# EAGLE design board (EAGLE 7.7.0)
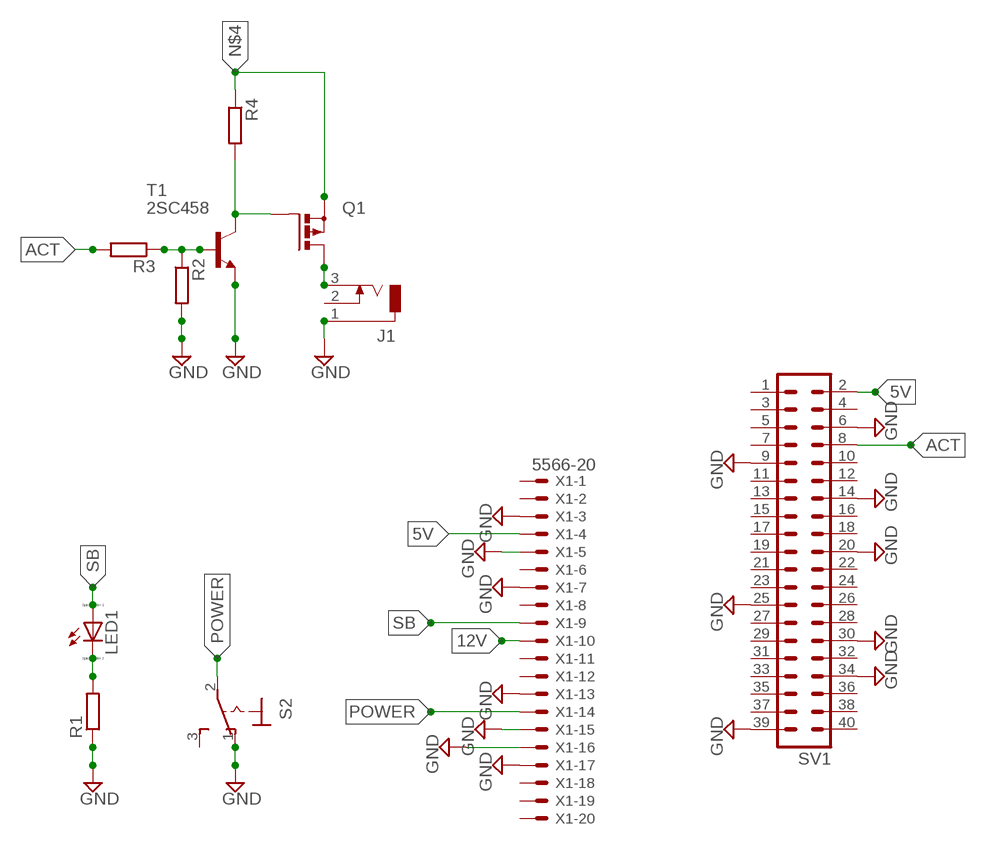
[diagram p0: schematic, sheet 1]

## Parts
J1  DCJ0303  [DCJ0303]
LED1  LED_ELD260  [LED_LD260]
Q1  PMOSFET_PTO220BV  [TO220BV]
R1  R-EU_0309/10  [0309/10]
R2  R-EU_0309/10  [0309/10]
R3  R-EU_0309/10  [0309/10]
R4  R-EU_0309/10  [0309/10]
S2  320-916  [320-916]
SV1  MA20-2  [MA20-2]
T1  2SC458  [TO92-ECB]
X1  5566-20  [5566-20]

## Nets
5V: SV1.2 X1.4
12V: X1.10
ACT: R3.2 SV1.8
GND: J1.1 R1.1 R2.2 S2.1(O) SV1.6 SV1.9 SV1.14 SV1.20 SV1.25 SV1.30 SV1.34 SV1.39 T1.E X1.3 X1.5 X1.7 X1.13 X1.15 X1.16 X1.17
N$1: LED1.K(C) R1.2
N$2: R2.1 R3.1 T1.B
N$3: Q1.G R4.2 T1.C
N$4: Q1.S R4.1
N$5: J1.3 Q1.D
POWER: S2.2(P) X1.14
SB: LED1.A X1.9
Unconnected: J1.2 S2.3(S) SV1.1 SV1.3 SV1.4 SV1.5 SV1.7 SV1.10 SV1.11 SV1.12 SV1.13 SV1.15 SV1.16 SV1.17 SV1.18 SV1.19 SV1.21 SV1.22 SV1.23 SV1.24 SV1.26 SV1.27 SV1.28 SV1.29 SV1.31 SV1.32 SV1.33 SV1.35 SV1.36 SV1.37 SV1.38 SV1.40 X1.1 X1.2 X1.6 X1.8 X1.11 X1.12 X1.18 X1.19 X1.20

## Library data of the parts
J1 = con-jack:DCJ0303: DC POWER JACK Source: DCJ0303.pdf; OC_FARNELL: unknown; OC_NEWARK: unknown
LED1 = eagle-ltspice:LED_E: LED Source: http://www.osram.convergy.de Source: www.luxeon.com Source: www.kingbright.com; SPICEMODEL: NONE; SPICEPREFIX: D; SPICETYPE: diode
Q1 = transistor-power:PMOSFET_P: Power MOSFET P-Channel
R1-R4 = resistor:R-EU_: RESISTOR, European symbol
S2 = switch:320-916: TOGGLE SWITCH distributor RS Components
SV1 = con-lstb:MA20-2: PIN HEADER; OC_FARNELL: unknown; OC_NEWARK: unknown
T1 = transistor:2SC458: NPN Silicon Epitaxial Planar Transistor Source: SEMTECH ELECTRONICS LTD. ... 2SC458 1.pdf
X1 = con-molex:5566-20: Mini FIT connector 20 pol ATX PC-Motherboard Power connector Source: http://www.molex.com; OC_FARNELL: unknown; OC_NEWARK: unknown

## Board
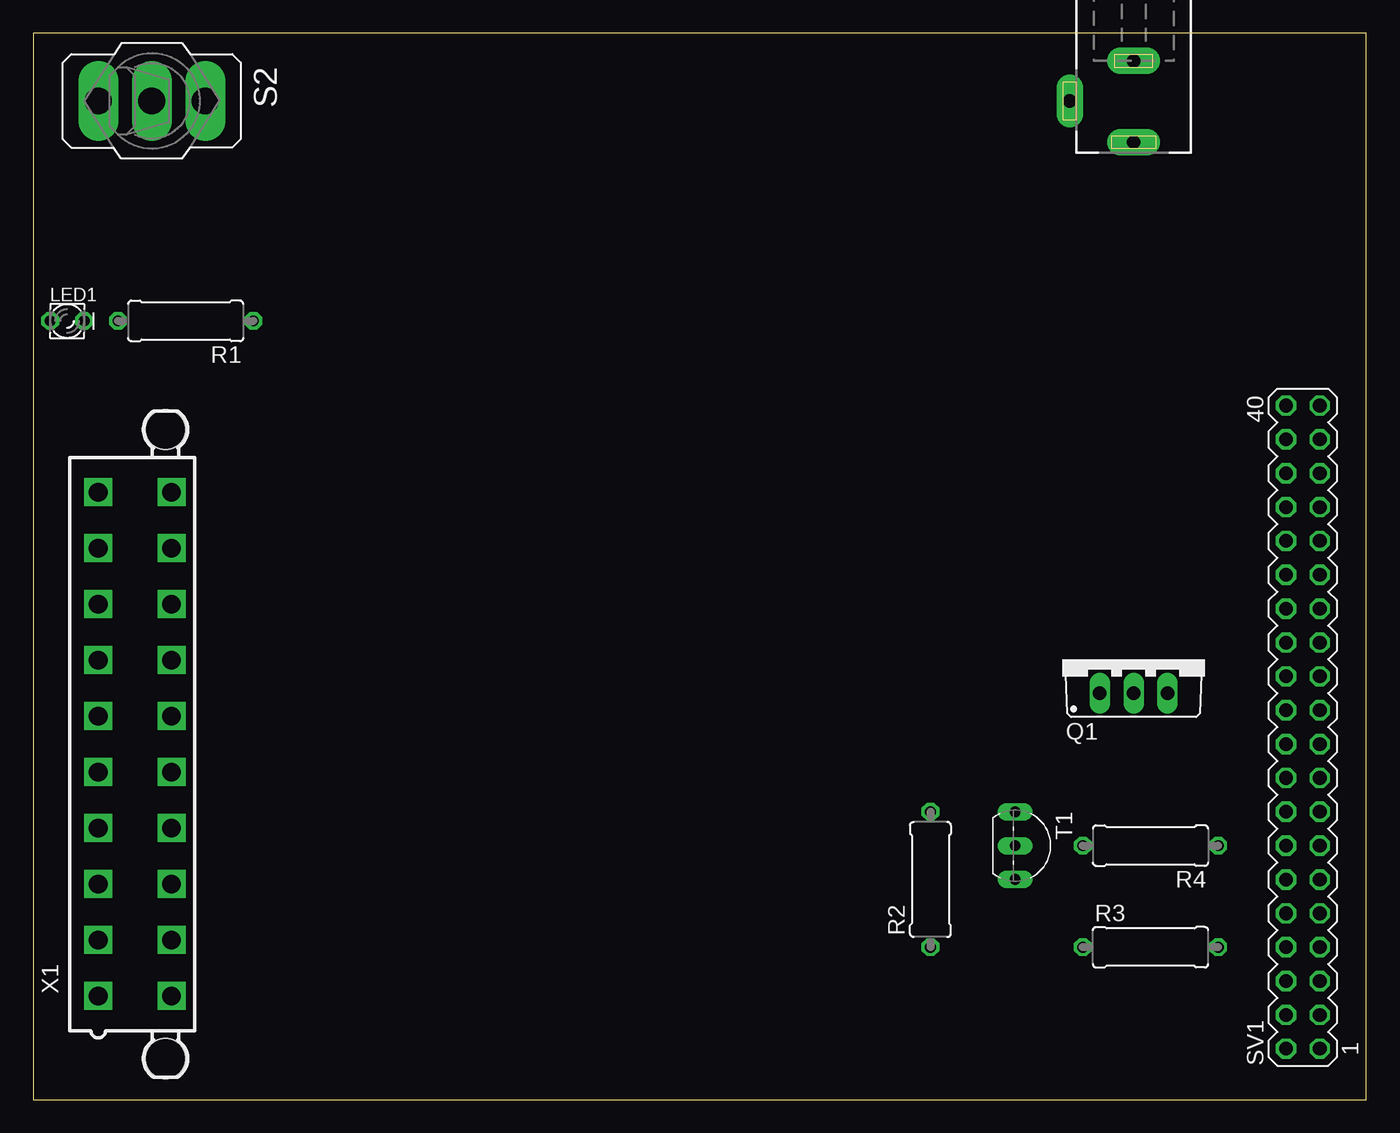
[diagram p1: board, top side]
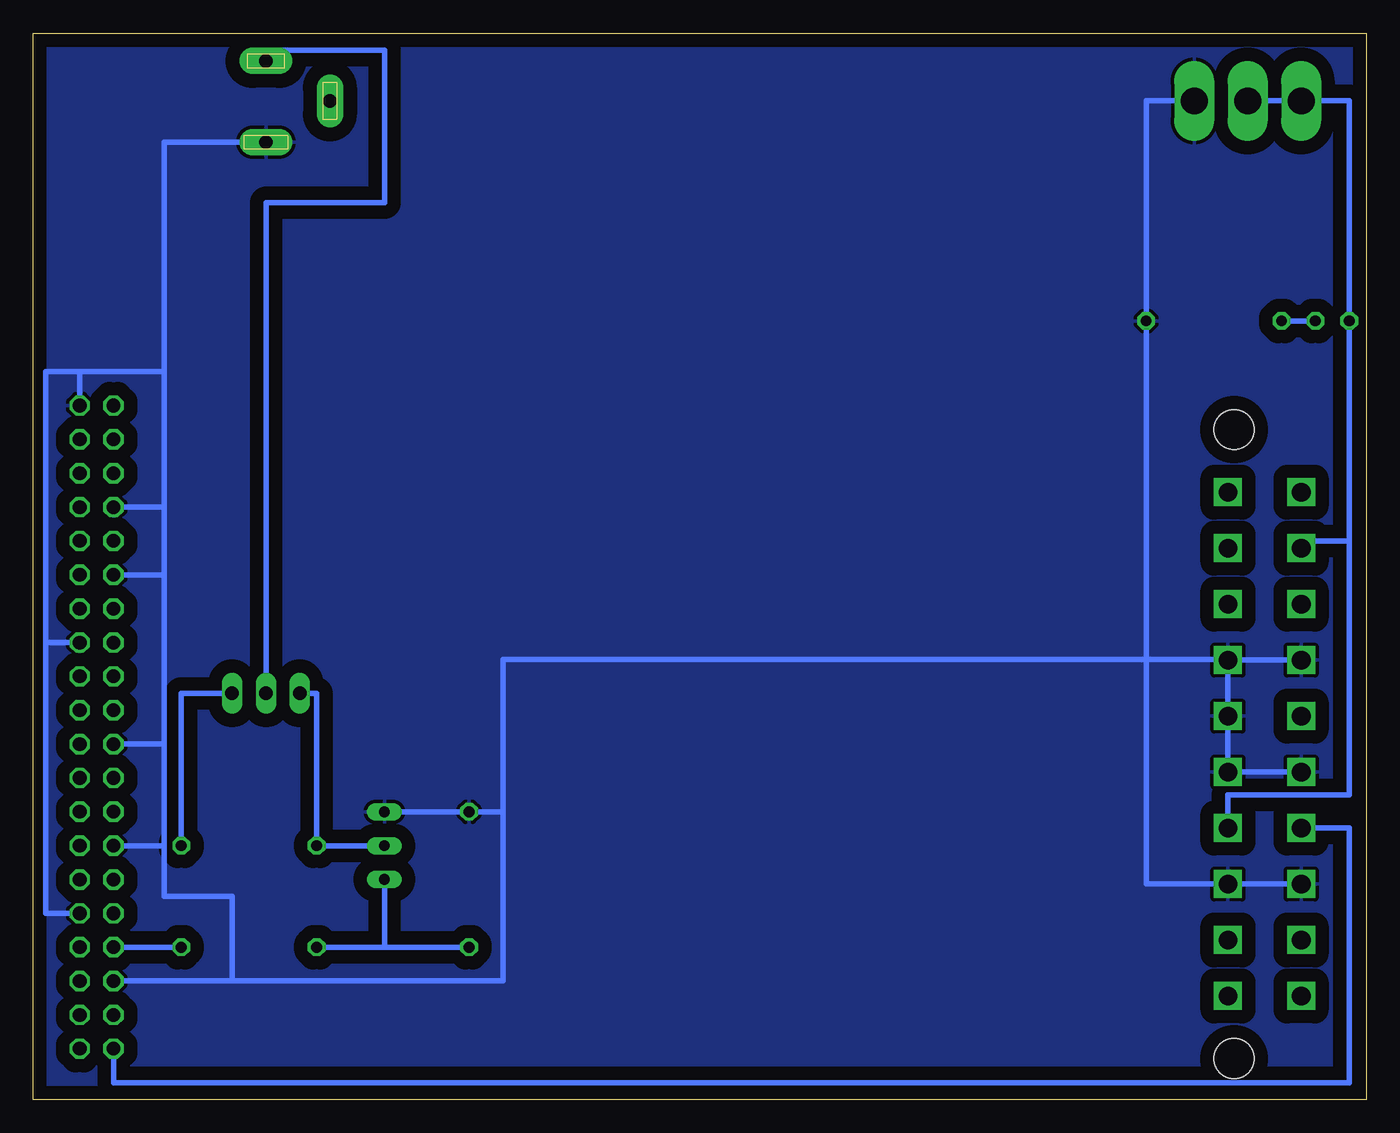
[diagram p2: board, bottom side, seen from below]

Size 100 x 80 mm. Coordinates in mm from the lower left corner, seen from the top.
Outline: 0,0 100,0 100,80 0,80 0,0
Copper layers (1*16): Top 0.035mm / dielectric 1.5mm / Bottom 0.035mm
Design rules "default": minimum track width 10mil, minimum drill 24mil, track to track 8mil, track to pad 8mil, pad to pad 8mil, via to via 8mil, smd to smd 8mil, copper to edge 40mil, drill to drill 8mil, minimum pad ring 10mil, minimum via ring 8mil, stop-mask expansion 4mil, vias tented up to drill 0mil, thermal gap 10mil

### Footprints (pad centres in the part's own frame; a part is rotated, then mirrored left to right if it is on the bottom)
DCJ0303 = drill 1 pad 2 long: 1 0,3.1; 2 4.8,0; 3 0,-3
LED_LD260 = drill 0.813 octagon: A -1.27,0; K 1.27,0
TO220BV = drill 1.016 long: D 0,-2.54; G -2.54,-2.54; S 2.54,-2.54
0309/10 = drill 0.813 octagon: 1 -5.08,0; 2 5.08,0
320-916 = drill 2.007 long: 1 0,4.013; 2 0,0; 3 0,-4.013
MA20-2 = drill 1.016 octagon: 1 -24.13,-1.27; 2 -24.13,1.27; 3 -21.59,-1.27; 4 -21.59,1.27; 5 -19.05,-1.27; 6 -19.05,1.27; 7 -16.51,-1.27; 8 -16.51,1.27; 9 -13.97,-1.27; 10 -13.97,1.27; 11 -11.43,-1.27; 12 -11.43,1.27; 13 -8.89,-1.27; 14 -8.89,1.27; 15 -6.35,-1.27; 16 -6.35,1.27; 17 -3.81,-1.27; 18 -3.81,1.27; 19 -1.27,-1.27; 20 -1.27,1.27; 21 1.27,-1.27; 22 1.27,1.27; 23 3.81,-1.27; 24 3.81,1.27; 25 6.35,-1.27; 26 6.35,1.27; 27 8.89,-1.27; 28 8.89,1.27; 29 11.43,-1.27; 30 11.43,1.27; 31 13.97,-1.27; 32 13.97,1.27; 33 16.51,-1.27; 34 16.51,1.27; 35 19.05,-1.27; 36 19.05,1.27; 37 21.59,-1.27; 38 21.59,1.27; 39 24.13,-1.27; 40 24.13,1.27
TO92-ECB = drill 0.813 long: B 2.54,0; C 0,0; E -2.54,0
5566-20 = drill 1.4 square: 1 18.9,-2.75; 2 14.7,-2.75; 3 10.5,-2.75; 4 6.3,-2.75; 5 2.1,-2.75; 6 -2.1,-2.75; 7 -6.3,-2.75; 8 -10.5,-2.75; 9 -14.7,-2.75; 10 -18.9,-2.75; 11 18.9,2.75; 12 14.7,2.75; 13 10.5,2.75; 14 6.3,2.75; 15 2.1,2.75; 16 -2.1,2.75; 17 -6.3,2.75; 18 -10.5,2.75; 19 -14.7,2.75; 20 -18.9,2.75 | hole 3: 23.6,2.29; -23.6,2.29

### Placement (x,y rotation side)
J1  82.55,74.93 180 top
LED1  2.54,58.42 0 top
Q1  82.55,33.02 0 top
R1  11.43,58.42 180 top
R2  67.31,16.51 90 top
R3  83.82,11.43 0 top
R4  83.82,19.05 180 top
S2  8.89,74.93 270 top
SV1  95.25,27.94 90 top
T1  73.66,19.05 270 top
X1  7.62,26.67 270 top

### Tracks (layer width: path | path; a pad name or v marks a point on that pad's centre or on a via)
5V
  Bottom 0.406: X1.4 1.27,20.37 1.27,1.27 93.98,1.27 SV1.2
ACT
  Bottom 0.406: R3.2 SV1.8
GND
  Bottom 0.406: T1.E R2.2 64.77,21.59 | SV1.39 96.52,54.61 | 96.52,54.61 90.17,54.61 | 90.17,54.61 90.17,44.45 | SV1.34 90.17,44.45 | 90.17,44.45 90.17,39.37 | 90.17,39.37 SV1.30 | SV1.20 90.17,26.67 | 90.17,26.67 90.17,39.37 | J1.1 90.17,71.83 90.17,54.61 | S2.1 16.51,74.93 R1.1 16.51,33.02 | 16.51,33.02 10.16,33.02 | 85.09,8.89 64.77,8.89 64.77,21.59 | SV1.14 90.17,19.05 | 90.17,19.05 90.17,26.67 | 99.06,34.29 99.06,13.97 SV1.9 | SV1.25 99.06,34.29 | 99.06,34.29 99.06,54.61 96.52,54.61 | X1.3 X1.13 16.51,16.17 16.51,33.02 | X1.5 X1.15 X1.16 X1.17 X1.7 | 16.51,33.02 64.77,33.02 64.77,21.59 | SV1.6 85.09,8.89 | 85.09,8.89 85.09,15.24 90.17,15.24 90.17,19.05
  pour Bottom (isolate 1.016): 0,80.01 100.33,80.01 100.33,0 0,0
N$1
  Bottom 0.406: LED1.K R1.2
N$2
  Bottom 0.406: R2.1 73.66,11.43 | 73.66,11.43 R3.1 | T1.B 73.66,11.43
N$3
  Bottom 0.406: T1.C R4.2 78.74,30.48 Q1.G
N$4
  Bottom 0.406: R4.1 88.9,30.48 Q1.S
N$5
  Bottom 0.406: Q1.D 82.55,67.31 73.66,67.31 73.66,78.74 82.55,78.74 J1.3
POWER
  Bottom 0.406: S2.2 1.27,74.93 1.27,22.86 10.37,22.86 X1.14
SB
  Bottom 0.406: LED1.A 1.27,41.91 4.87,41.91 X1.9